# Altium schematic sheet ESP32.SchDoc
size A4; SheetNumber: 9; SheetTotal: 9
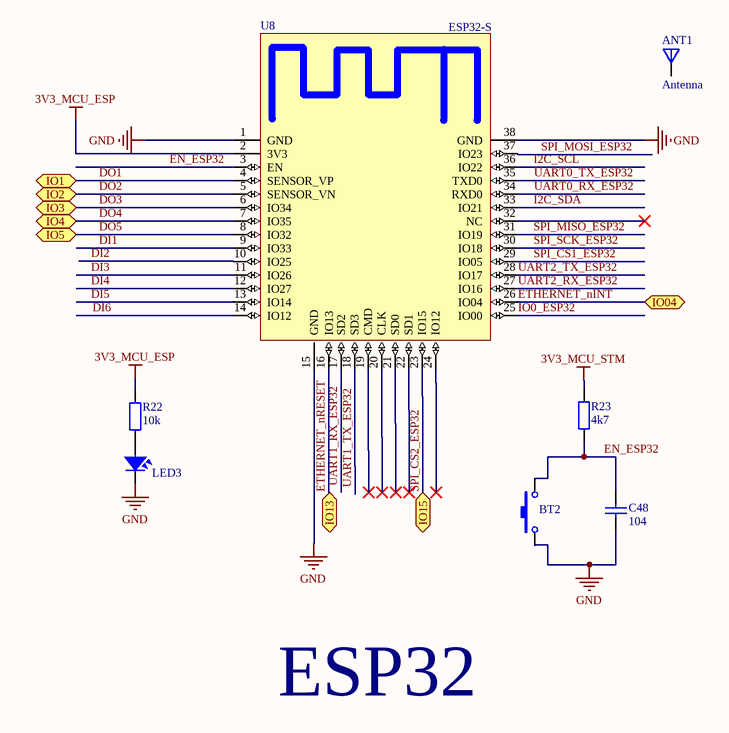
[diagram p0: ESP32.SchDoc]

## Parts
ANT1  Antenna  [ANTENNA]
BT2  SW  [BUTTON RIGHT ANGLE]  (value not drawn)
C48  104  [0603_Cap]
LED3  LED  [0603_LED]  (value not drawn)
R22  10k  [0603_Res]
R23  4k7  [0603_Res]
U8  ESP32-S  [ESP32-S]

## Ports
IO1 (bidir), IO2 (bidir), IO3 (bidir), IO04 (bidir), IO4 (bidir), IO5 (bidir), IO13 (bidir), IO15 (bidir)

## Nets
3V3_MCU_ESP: R22.2 U8.2(3V3)
3V3_MCU_STM: R23.2
GND: BT2.1 C48.1 LED3.C(Cathode) U8.1(GND) U8.15(GND) U8.38(GND)
DI1: U8.9(IO33)
DI2: U8.10(IO25)
DI3: U8.11(IO26)
DI4: U8.12(IO27)
DI5: U8.13(IO14)
DI6: U8.14(IO12)
DO1: U8.4(SENSOR_VP) ; port IO1
DO2: U8.5(SENSOR_VN) ; port IO2
DO3: U8.6(IO34) ; port IO3
DO4: U8.7(IO35) ; port IO4
DO5: U8.8(IO32) ; port IO5
EN_ESP32: BT2.2 C48.2 R23.1 U8.3(EN)
ETHERNET_nINT: U8.26(IO04) ; port IO04
ETHERNET_nRESET: U8.16(IO13) ; port IO13
I2C_SCL: U8.36(IO22)
I2C_SDA: U8.33(IO21)
IO0_ESP32: U8.25(IO00)
SPI_CS1_ESP32: U8.29(IO05)
SPI_CS2_ESP32: U8.23(IO15) ; port IO15
SPI_MISO_ESP32: U8.31(IO19)
SPI_MOSI_ESP32: U8.37(IO23)
SPI_SCK_ESP32: U8.30(IO18)
UART0_RX_ESP32: U8.34(RXD0)
UART0_TX_ESP32: U8.35(TXD0)
UART1_RX_ESP32: U8.17(SD2)
UART1_TX_ESP32: U8.18(SD3)
UART2_RX_ESP32: U8.27(IO16)
UART2_TX_ESP32: U8.28(IO17)
NetLED3_A: LED3.A(Anode) R22.1

Not connected (* = marked no-connect by the designer): ANT1 1(ANT); U8 19(CMD)* 20(CLK)* 21(SD0)* 22(SD1)* 24(IO12)* 32(NC)*

## Notes on the sheet
- ESP32

## Library data of the parts
BT2 = SW-Button: Switch-Button; Published: 24-Mar-1999; LatestRevisionDate: 17-Jul-2002; LatestRevisionNote: Re-released for DXP Platform.; PackageReference: SPST-2; Publisher: Altium Limited
C48 = Ceramic Capacitor: Chung_Loai: Dán; Don_Vi: Con; So_Chan: 2; Ten_Linh_Kien: Tụ 0805 104-100nF 10% 50V; Ma_Hang: MH004551; Kieu_Chan: *
LED3 = LED: LED single color 2 leads
R22 R23 = Resistor: Chung_Loai: Dán; Don_Vi: Con; So_Chan: 2; Ten_Linh_Kien: Trở 0805 1% 1k; Ma_Hang: MH005468; Kieu_Chan: *